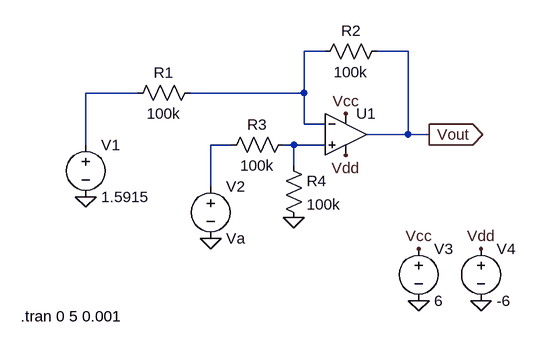
[diagram p0: schematic Offset_generisk.asc]
Offset_generisk.asc, the LTspice schematic file:
Version 4
SHEET 1 880 680
WIRE 512 -16 480 -16
WIRE 640 -16 592 -16
WIRE 224 48 144 48
WIRE 480 48 480 -16
WIRE 480 48 304 48
WIRE 480 96 480 48
WIRE 512 96 480 96
WIRE 640 112 640 -16
WIRE 640 112 576 112
WIRE 672 112 640 112
WIRE 144 128 144 48
WIRE 368 128 336 128
WIRE 464 128 448 128
WIRE 512 128 464 128
WIRE 464 160 464 128
WIRE 336 192 336 128
FLAG 336 272 0
FLAG 144 208 0
FLAG 656 368 0
FLAG 752 368 0
FLAG 544 80 Vcc
FLAG 656 288 Vcc
FLAG 544 144 Vdd
FLAG 752 288 Vdd
FLAG 672 112 Vout
IOPIN 672 112 Out
FLAG 464 240 0
SYMBOL voltage 144 112 R0
WINDOW 123 0 0 Left 2
WINDOW 39 0 0 Left 2
SYMATTR InstName V1
SYMATTR Value 1.5915
SYMBOL voltage 656 272 R0
WINDOW 123 0 0 Left 2
WINDOW 39 0 0 Left 2
SYMATTR InstName V3
SYMATTR Value 6
SYMBOL voltage 752 272 R0
WINDOW 123 0 0 Left 2
WINDOW 39 0 0 Left 2
SYMATTR InstName V4
SYMATTR Value -6
SYMBOL res 208 64 R270
WINDOW 0 32 56 VTop 2
WINDOW 3 0 56 VBottom 2
SYMATTR InstName R1
SYMATTR Value 100k
SYMBOL res 496 0 R270
WINDOW 0 32 56 VTop 2
WINDOW 3 0 56 VBottom 2
SYMATTR InstName R2
SYMATTR Value 100k
SYMBOL res 352 144 R270
WINDOW 0 32 56 VTop 2
WINDOW 3 0 56 VBottom 2
SYMATTR InstName R3
SYMATTR Value 100k
SYMBOL res 448 144 R0
SYMATTR InstName R4
SYMATTR Value 100k
SYMBOL voltage 336 176 R0
WINDOW 123 0 0 Left 2
WINDOW 39 0 0 Left 2
SYMATTR InstName V2
SYMATTR Value Va
SYMBOL Opamps\\UniversalOpamp2 544 112 R0
SYMATTR InstName U1
TEXT 44 392 Left 2 !.tran 0 5 0.001

The netlist it stands for:
* Offset_generisk.asc
V1 N002 0 1.5915
V3 Vcc 0 6
V4 Vdd 0 -6
R1 N002 N001 100k
R2 N001 Vout 100k
R3 N003 N004 100k
R4 N004 0 100k
V2 N003 0 Va
XU1 N004 N001 Vcc Vdd Vout level.2 Avol=1Meg GBW=10Meg Slew=10Meg ilimit=25m rail=0 Vos=0 phimargin=45 en=0 enk=0 in=0 ink=0 Rin=500Meg  ; pins IN+ IN- V+ V- OUT
.tran 0 5 0.001
.lib UniversalOpamps2.sub
.backanno
.end